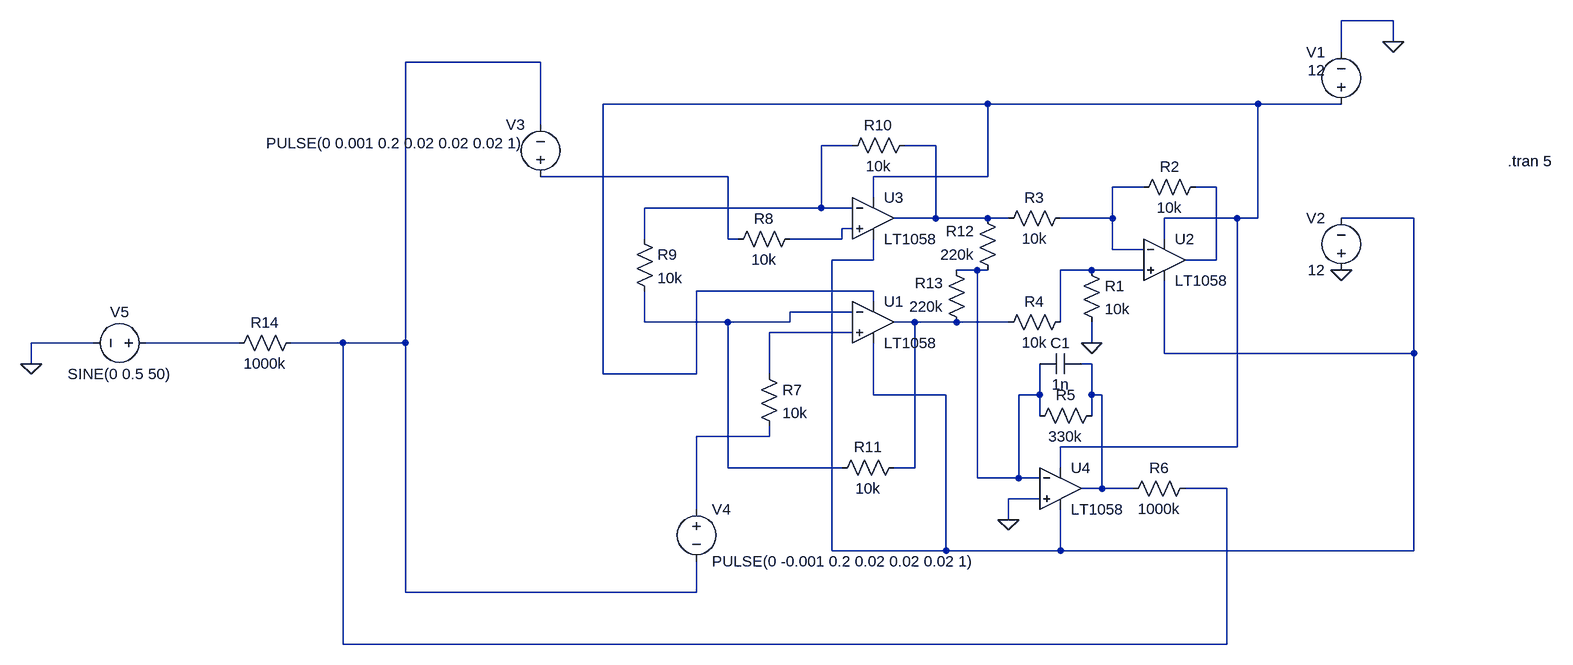
[diagram p0: schematic Differential_amplifier.asc]
Differential_amplifier.asc, the LTspice schematic file:
Version 4
SHEET 1 1108 1044
WIRE 800 -240 720 -240
WIRE 800 -208 800 -240
WIRE 720 -192 720 -240
WIRE -512 -176 -720 -176
WIRE 176 -112 -416 -112
WIRE 592 -112 176 -112
WIRE 720 -112 592 -112
WIRE -512 -80 -512 -176
WIRE -32 -48 -80 -48
WIRE 96 -48 48 -48
WIRE -224 0 -512 0
WIRE 176 0 176 -112
WIRE 176 0 0 0
WIRE 416 16 368 16
WIRE 528 16 496 16
WIRE 0 32 0 0
WIRE -80 48 -80 -48
WIRE -80 48 -352 48
WIRE -32 48 -80 48
WIRE 96 64 96 -48
WIRE 96 64 32 64
WIRE 176 64 96 64
WIRE 208 64 176 64
WIRE 368 64 368 16
WIRE 368 64 288 64
WIRE 560 64 448 64
WIRE 592 64 592 -112
WIRE 592 64 560 64
WIRE 832 64 720 64
WIRE -32 80 -48 80
WIRE -352 96 -352 48
WIRE -224 96 -224 0
WIRE -208 96 -224 96
WIRE -48 96 -48 80
WIRE -48 96 -128 96
WIRE 448 96 448 64
WIRE 368 112 368 64
WIRE 416 112 368 112
WIRE 0 128 0 96
WIRE 0 128 -64 128
WIRE 528 128 528 16
WIRE 528 128 480 128
WIRE 160 144 128 144
WIRE 176 144 160 144
WIRE 336 144 288 144
WIRE 416 144 336 144
WIRE 0 176 -272 176
WIRE 0 192 0 176
WIRE -32 208 -128 208
WIRE -352 224 -352 176
WIRE -224 224 -352 224
WIRE -128 224 -128 208
WIRE -128 224 -224 224
WIRE 64 224 32 224
WIRE 128 224 64 224
WIRE 208 224 128 224
WIRE 288 224 288 144
WIRE -32 240 -160 240
WIRE -1200 256 -1296 256
WIRE -976 256 -1120 256
WIRE -816 256 -896 256
WIRE -720 256 -720 -176
WIRE -720 256 -816 256
WIRE 336 256 336 224
WIRE 448 272 448 160
WIRE 832 272 832 64
WIRE 832 272 448 272
WIRE -1296 288 -1296 256
WIRE 336 288 320 288
WIRE -416 304 -416 -112
WIRE -272 304 -272 176
WIRE -272 304 -416 304
WIRE -160 304 -160 240
WIRE 0 336 0 256
WIRE 112 336 0 336
WIRE 256 336 256 288
WIRE 256 336 224 336
WIRE 336 336 336 288
WIRE 352 336 336 336
WIRE 256 368 256 336
WIRE 336 368 336 336
WIRE -160 400 -160 384
WIRE -160 400 -272 400
WIRE 560 416 560 64
WIRE 560 416 288 416
WIRE -224 448 -224 224
WIRE -48 448 -224 448
WIRE 64 448 64 224
WIRE 64 448 32 448
WIRE 288 448 288 416
WIRE 160 464 160 144
WIRE 224 464 224 336
WIRE 224 464 160 464
WIRE 256 464 224 464
WIRE 352 480 352 336
WIRE 352 480 320 480
WIRE 400 480 352 480
WIRE 544 480 480 480
WIRE 256 496 208 496
WIRE -272 512 -272 400
WIRE 208 528 208 496
WIRE -64 576 -64 128
WIRE 112 576 112 336
WIRE 112 576 -64 576
WIRE 288 576 288 512
WIRE 288 576 112 576
WIRE 832 576 832 272
WIRE 832 576 288 576
WIRE -720 640 -720 256
WIRE -272 640 -272 592
WIRE -272 640 -720 640
WIRE -816 720 -816 256
WIRE 544 720 544 480
WIRE 544 720 -816 720
FLAG 208 528 0
FLAG 336 256 0
FLAG 720 144 0
FLAG 800 -208 0
FLAG -1296 288 0
SYMBOL OpAmps\\LT1058 0 0 R0
SYMATTR InstName U3
SYMBOL OpAmps\\LT1058 0 160 R0
SYMATTR InstName U1
SYMBOL OpAmps\\LT1058 448 64 R0
SYMATTR InstName U2
SYMBOL OpAmps\\LT1058 288 416 R0
SYMATTR InstName U4
SYMBOL res 320 128 R0
SYMATTR InstName R1
SYMATTR Value 10k
SYMBOL res 512 0 R90
WINDOW 0 0 56 VBottom 2
WINDOW 3 32 56 VTop 2
SYMATTR InstName R2
SYMATTR Value 10k
SYMBOL res 304 48 R90
WINDOW 0 0 56 VBottom 2
WINDOW 3 32 56 VTop 2
SYMATTR InstName R3
SYMATTR Value 10k
SYMBOL res 304 208 R90
WINDOW 0 0 56 VBottom 2
WINDOW 3 32 56 VTop 2
SYMATTR InstName R4
SYMATTR Value 10k
SYMBOL res 352 352 R90
WINDOW 0 0 56 VBottom 2
WINDOW 3 32 56 VTop 2
SYMATTR InstName R5
SYMATTR Value 330k
SYMBOL cap 320 272 R90
WINDOW 0 0 32 VBottom 2
WINDOW 3 32 32 VTop 2
SYMATTR InstName C1
SYMATTR Value 1n
SYMBOL res 496 464 R90
WINDOW 0 0 56 VBottom 2
WINDOW 3 32 56 VTop 2
SYMATTR InstName R6
SYMATTR Value 1000k
SYMBOL res -368 80 R0
SYMATTR InstName R9
SYMATTR Value 10k
SYMBOL res 64 -64 R90
WINDOW 0 0 56 VBottom 2
WINDOW 3 32 56 VTop 2
SYMATTR InstName R10
SYMATTR Value 10k
SYMBOL res 48 432 R90
WINDOW 0 0 56 VBottom 2
WINDOW 3 32 56 VTop 2
SYMATTR InstName R11
SYMATTR Value 10k
SYMBOL res 192 160 R180
WINDOW 0 36 76 Left 2
WINDOW 3 36 40 Left 2
SYMATTR InstName R12
SYMATTR Value 220k
SYMBOL res 144 240 R180
WINDOW 0 36 76 Left 2
WINDOW 3 36 40 Left 2
SYMATTR InstName R13
SYMATTR Value 220k
SYMBOL voltage 720 -96 R180
WINDOW 0 24 96 Left 2
WINDOW 3 24 68 Left 2
WINDOW 123 0 0 Left 0
WINDOW 39 0 0 Left 0
SYMATTR InstName V1
SYMATTR Value 12
SYMBOL voltage 720 160 R180
WINDOW 0 24 96 Left 2
WINDOW 3 24 16 Left 2
WINDOW 123 0 0 Left 0
WINDOW 39 0 0 Left 0
SYMATTR InstName V2
SYMATTR Value 12
SYMBOL voltage -512 16 R180
WINDOW 0 24 96 Left 2
WINDOW 3 24 68 Left 2
WINDOW 123 0 0 Left 0
WINDOW 39 0 0 Left 0
SYMATTR InstName V3
SYMATTR Value PULSE(0 0.001 0.2 0.02 0.02 0.02 1)
SYMBOL voltage -272 496 R0
WINDOW 123 0 0 Left 0
WINDOW 39 0 0 Left 0
SYMATTR InstName V4
SYMATTR Value PULSE(0 -0.001 0.2 0.02 0.02 0.02 1)
SYMBOL voltage -1104 256 R90
WINDOW 0 -32 56 VBottom 2
WINDOW 3 32 56 VTop 2
WINDOW 123 0 0 Left 0
WINDOW 39 0 0 Left 0
SYMATTR InstName V5
SYMATTR Value SINE(0 0.5 50)
SYMBOL res -880 240 R90
WINDOW 0 0 56 VBottom 2
WINDOW 3 32 56 VTop 2
SYMATTR InstName R14
SYMATTR Value 1000k
SYMBOL res -176 288 R0
SYMATTR InstName R7
SYMATTR Value 10k
SYMBOL res -112 80 R90
WINDOW 0 0 56 VBottom 2
WINDOW 3 32 56 VTop 2
SYMATTR InstName R8
SYMATTR Value 10k
TEXT 976 -24 Left 2 !.tran 5

The netlist it stands for:
* Differential_amplifier.asc
XU3 N009 N003 N002 N008 N004 LT1057  ; LT1058, pins In+ In- V+ V- OUT
XU1 N014 N012 N002 N008 N013 LT1057  ; LT1058, pins In+ In- V+ V- OUT
XU2 N011 N006 N002 N008 N007 LT1057  ; LT1058, pins In+ In- V+ V- OUT
XU4 0 N010 N002 N008 N016 LT1057  ; LT1058, pins In+ In- V+ V- OUT
R1 N011 0 10k
R2 N007 N006 10k
R3 N006 N004 10k
R4 N011 N013 10k
R5 N016 N010 330k
C1 N016 N010 1n
R6 N001 N016 1000k
R9 N003 N012 10k
R10 N004 N003 10k
R11 N013 N012 10k
R12 N010 N004 220k
R13 N013 N010 220k
V1 N002 0 12
V2 0 N008 12
V3 N005 N001 PULSE(0 0.001 0.2 0.02 0.02 0.02 1)
V4 N017 N001 PULSE(0 -0.001 0.2 0.02 0.02 0.02 1)
V5 N015 0 SINE(0 0.5 50)
R14 N001 N015 1000k
R7 N014 N017 10k
R8 N009 N005 10k
.tran 5
.lib LTC.lib
.backanno
.end